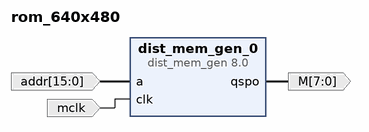
[diagram p0: block diagram of the top level]
# Vivado block design rom_640x480, xc7a35tcpg236-1, Vivado 2021.2
create_bd_design rom_640x480

create_bd_port -dir I -from 15 -to 0 addr
create_bd_port -dir I mclk
create_bd_port -dir O -from 7 -to 0 M

create_bd_cell -type ip -vlnv xilinx.com:ip:dist_mem_gen:8.0 dist_mem_gen_0
set_property -dict [list \
  CONFIG.coefficient_file ../../../../../../imagen1.coe \
  CONFIG.data_width 8 \
  CONFIG.depth 38400 \
  CONFIG.input_options registered \
  CONFIG.memory_type rom \
  CONFIG.output_options registered \
] [get_bd_cells dist_mem_gen_0]

# ---- connections ----

connect_bd_net -net a_0_1 [get_bd_ports addr] [get_bd_pins dist_mem_gen_0/a]
connect_bd_net -net clk_0_1 [get_bd_ports mclk] [get_bd_pins dist_mem_gen_0/clk]
connect_bd_net [get_bd_pins dist_mem_gen_0/qspo] [get_bd_ports M]

validate_bd_design
save_bd_design
